# EAGLE design p2-002 (EAGLE 9.6.2)
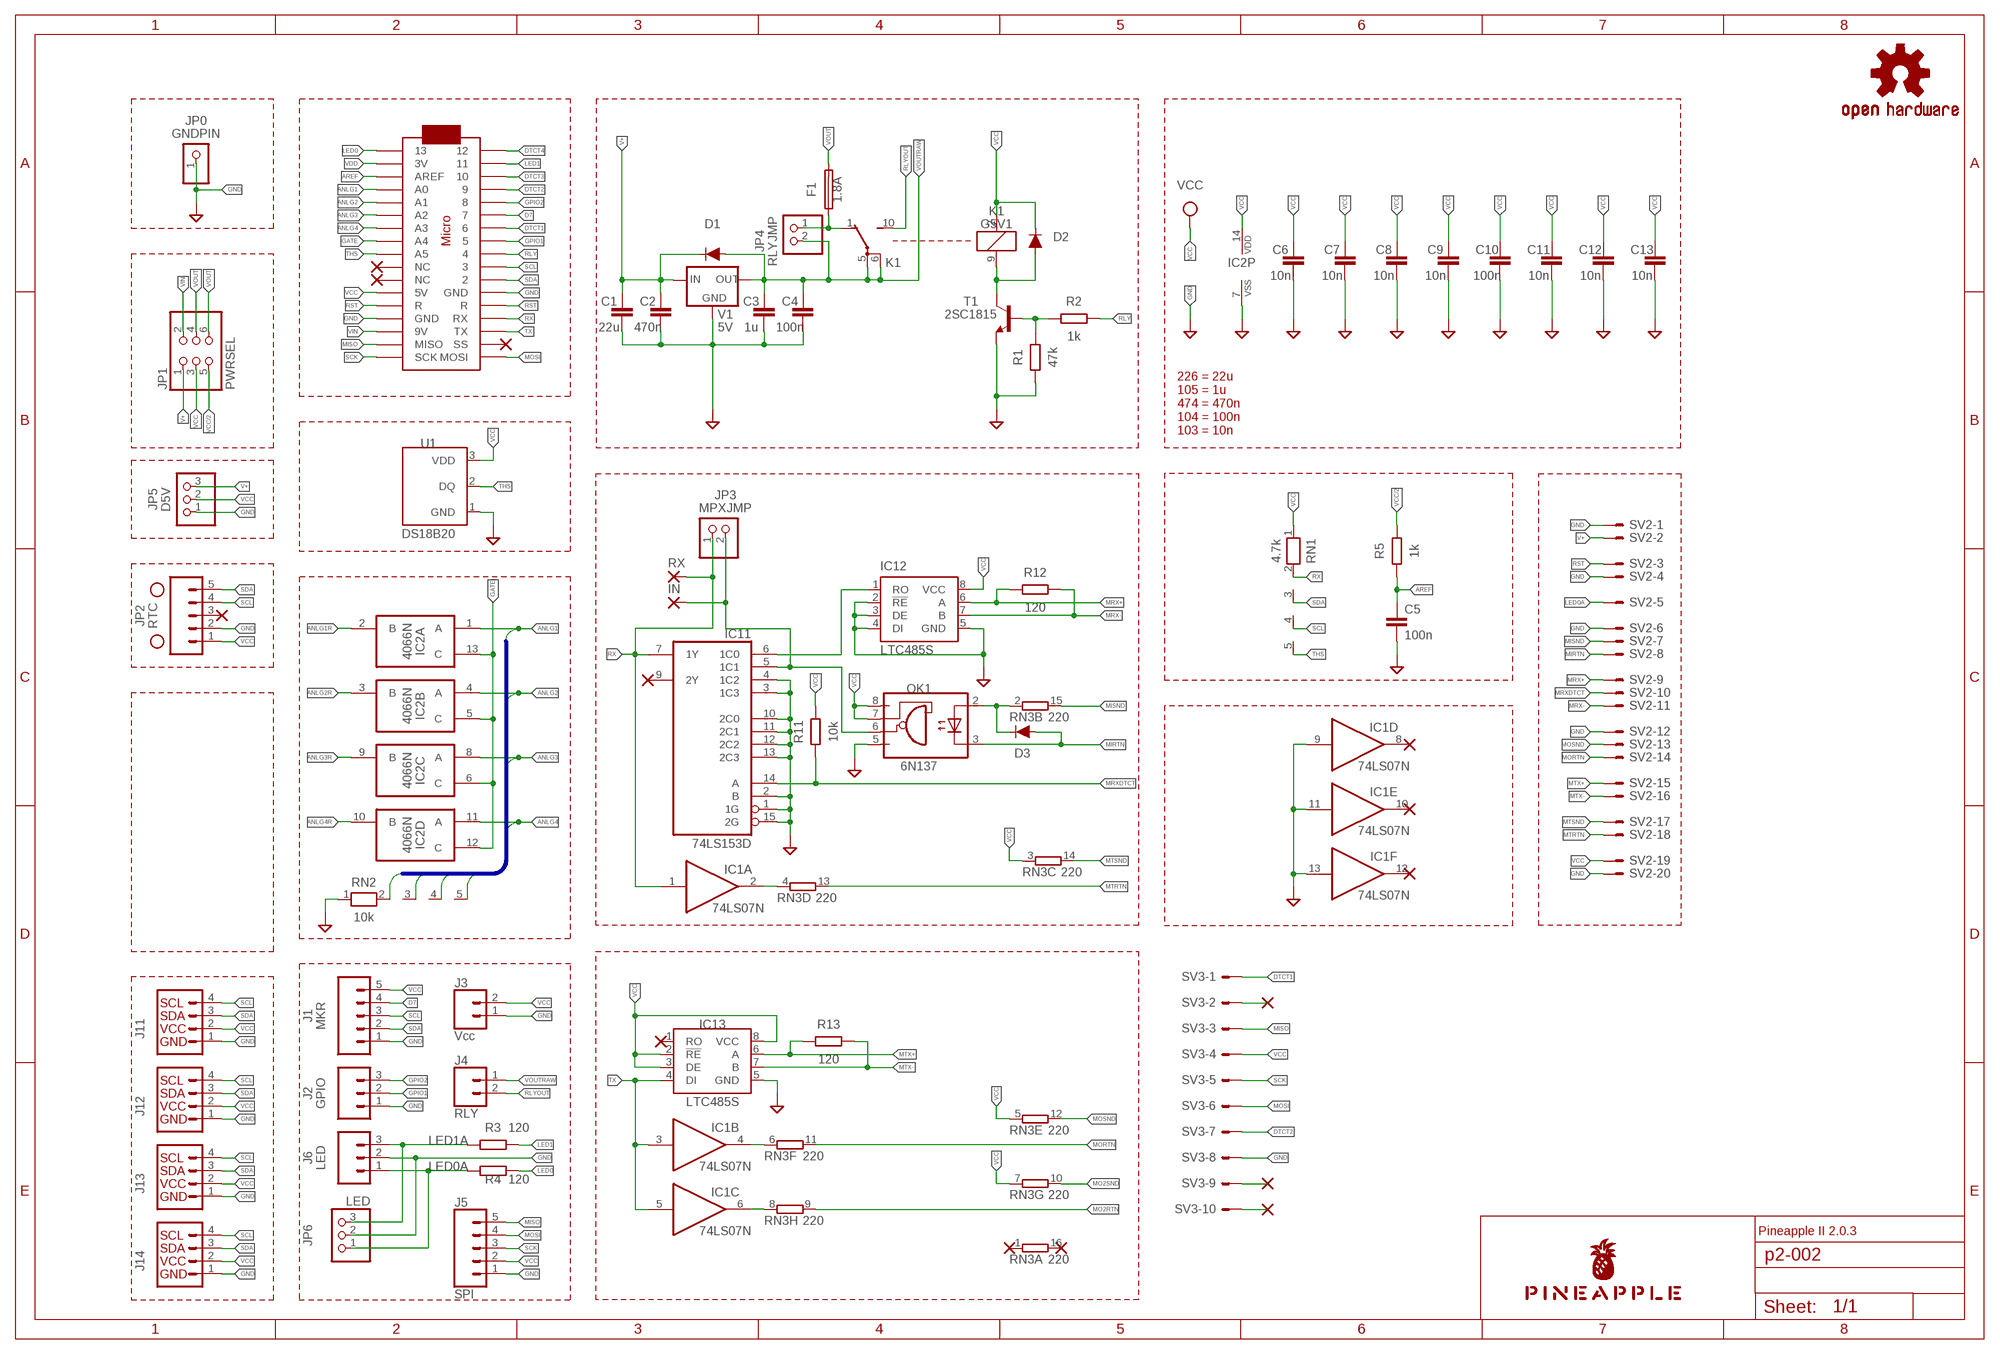
[diagram p0: schematic, sheet 1]

## Parts
C1  22u  C-EU025-050X050  [C025-050X050]
C2  470n  C-EU050-024X044  [C050-024X044]
C3  1u  C-EU050-024X044  [C050-024X044]
C4  100n  C-EU025-024X044  [C025-024X044]
C5  100n  C-EU025-024X044  [C025-024X044]
C6  10n  C-EU025-024X044  [C025-024X044]
C7  10n  C-EU025-024X044  [C025-024X044]
C8  10n  C-EU025-024X044  [C025-024X044]
C9  10n  C-EU025-024X044  [C025-024X044]
C10  100n  C-EU025-024X044  [C025-024X044]
C11  10n  C-EUC2012  [C2012]
C12  10n  C-EUC2012  [C2012]
C13  10n  C-EUC2012  [C2012]
D1  DIODE-1N4148  [DIODE-1N4148]
D2  DIODE-1N4148  [DIODE-1N4148]
D3  DIODE-1N4148  [DIODE-1N4148]
F1  1.8A  TE5  [TE5]
H1  STAND-OFF  [STAND-OFF]
H2  STAND-OFF  [STAND-OFF]
IC1  74LS07N  [DIL14]
IC2  4066N  [DIL14]
IC11  74LS153D  [SO16]
IC12  LTC485S  [SOIC8]
IC13  LTC485S  [SOIC8]
IN  SMD2  [SMD1,27-2,54]
J1  MKR  CONN_05JST  [JST-5-PTH]
J2  GPIO  CONN_03JST-PTH  [JST-3-PTH]
J3  Vcc  CONN_02JST-PTH-2  [JST-2-PTH]
J4  RLY  CONN_02-JST-2MM-SMT  [JST-2-SMD]
J5  SPI  CONN_05JST-VERT  [JST-5-PTH-VERT]
J6  LED  CONN_03JST-PTH  [JST-3-PTH]
J11  Qwiic  QWIIC_CONNECTORJS-1MM  [1X04_1MM_RA]
J12  Qwiic  QWIIC_CONNECTORJS-1MM  [1X04_1MM_RA]
J13  Qwiic  QWIIC_CONNECTORJS-1MM  [1X04_1MM_RA]
J14  Qwiic  QWIIC_CONNECTORJS-1MM  [1X04_1MM_RA]
JP0  GNDPIN  PINHD-1X1  [1X01]
JP1  PWRSEL  PINHD-2X3  [2X03]
JP2  RTC  CONN_05  [1X05]
JP3  MPXJMP  PINHD-1X2  [1X02]
JP4  RLYJMP  PINHD-1X2  [1X02]
JP5  D5V  PINHD-1X3  [1X03]
JP6  LED  PINHD-1X3  [1X03]
K1  G5V1  [G5V1]
LOGO1  OSHW-LOGOS-COPPER  [OSHW-LOGO-S_COPPER]
MC1  ARDUINOMICRO  [ARDUINOMICRO]
OK1  6N137  [DIL08]
R1  47k  R-EU_0204/5  [0204/5]
R2  1k  R-EU_0204/5  [0204/5]
R3  120  R-EU_0204/5  [0204/5]
R4  120  R-EU_0204/5  [0204/5]
R5  1k  R-EU_0204/5  [0204/5]
R11  10k  R-EU_M2012  [M2012]
R12  120  R-EU_M2012  [M2012]
R13  120  R-EU_M2012  [M2012]
RN1  4.7k  RN04  [RN-5]
RN2  10k  RN04  [RN-5]
RN3  220  8R-N  [DIL16]
RX  SMD2  [SMD1,27-2,54]
SV2  ML20LE  [ML20L]
SV3  ML10LE  [ML10L]
T1  2SC1815  [TO92-ECB]
U1  DS18B20  [TO-92-AMMO]
U$1  PINEAPPLE450_SILK  [PINEAPPLE450_SILK]
V1  5V  78XXL  [78XXL]

## Nets
ANLG1: IC2.1(A:A) MC1.P$31(A0) RN2.2
ANLG1R: IC2.2(A:B)
ANLG2: IC2.4(B:A) MC1.P$30(A1) RN2.3
ANLG2R: IC2.3(B:B)
ANLG3: IC2.8(C:A) MC1.P$29(A2) RN2.4
ANLG3R: IC2.9(C:B)
ANLG4: IC2.11(D:A) MC1.P$28(A3) RN2.5
ANLG4R: IC2.10(D:B)
AREF: C5.1 MC1.P$32(AREF) R5.1
D7: J1.4 MC1.P$6
DTCT1: MC1.P$7 SV3.1
DTCT2: MC1.P$4 SV3.7
DTCT3: MC1.P$3
DTCT4: MC1.P$1
GATE: IC2.5(B:C) IC2.6(C:C) IC2.12(D:C) IC2.13(A:C) MC1.P$27(A4)
GND [gnd]: C1.2 C2.2 C3.2 C4.2 C5.2 C6.2 C7.2 C8.2 C9.2 C10.2 C11.2 C12.2 C13.2 IC1.9(D:I) IC1.11(E:I) IC1.13(F:I) IC2.7(P:VSS) IC11.1(1G) IC11.2(B) IC11.3(1C3) IC11.4(1C2) IC11.10(2C0) IC11.11(2C1) IC11.12(2C2) IC11.13(2C3) IC11.15(2G) IC12.2(!RE) IC12.3(DE) IC12.4(DI) IC12.5(GND) IC13.5(GND) J1.1 J2.1 J3.1 J5.1 J6.2 J11.1(GND) J12.1(GND) J13.1(GND) J14.1(GND) JP0.1 JP2.2 JP5.1 JP6.2 MC1.P$12(GND) MC1.P$21(GND) OK1.5(GND) R1.1 RN2.1 SV2.1 SV2.4 SV2.6 SV2.12 SV2.20 SV3.8 T1.E U1.1(GND) V1.GND
GPIO1: J2.2 MC1.P$8
GPIO2: J2.3 MC1.P$5
LED0: MC1.P$34 R4.2
LED0A: J6.1 JP6.1 R4.1 SV2.5
LED1: MC1.P$2 R3.2
LED1A: J6.3 JP6.3 R3.1
MIDIINSND: D3.C OK1.2(A) RN3.2
MIN: IC11.5(1C1) IN.1(P) JP3.2 OK1.6(VO)
MIRTN: D3.A OK1.3(C) SV2.8
MISND: RN3.15 SV2.7
MISO: J5.5 MC1.P$19(MISO) SV3.3
MO: IC1.4(B:O) RN3.6
MO2: IC1.6(C:O) RN3.8
MO2RTN: RN3.9
MO2SND: RN3.10
MORTN: RN3.11 SV2.14
MOSI: J5.4 MC1.P$17(MOSI) SV3.6
MOSND: RN3.12 SV2.13
MRX: IC11.6(1C0) IC12.1(RO)
MRX+: IC12.6(A) R12.1 SV2.9
MRX-: IC12.7(B) R12.2 SV2.11
MRXDTCT: IC11.14(A) R11.1 SV2.10
MT: IC1.2(A:O) RN3.4
MTRTN: RN3.13 SV2.18
MTSND: RN3.14 SV2.17
MTX+: IC13.6(A) R13.1 SV2.15
MTX-: IC13.7(B) R13.2 SV2.16
NC1: SV3.2
NC2: SV3.9
NC3: SV3.10
RLY: MC1.P$9 R2.2
RLYDRV: R1.2 R2.1 T1.B
RLYOUT: J4.2 K1.10(2:S)
RLYSNK: D2.A K1.9 T1.C
RST: MC1.P$13(R) MC1.P$22(R) SV2.3
RX: IC1.1(A:I) IC11.7(1Y) JP3.1 MC1.P$14(RX) RN1.2 RX.1(P)
SCK: J5.3 MC1.P$18(SCK) SV3.5
SCL: J1.3 J11.4(SCL) J12.4(SCL) J13.4(SCL) J14.4(SCL) JP2.4 MC1.P$10 RN1.4
SDA: J1.2 J11.3(SDA) J12.3(SDA) J13.3(SDA) J14.3(SDA) JP2.5 MC1.P$11 RN1.3
THS: MC1.P$26(A5) RN1.5 U1.2(DQ)
TX: IC1.3(B:I) IC1.5(C:I) IC13.4(DI) MC1.P$15(TX)
V+ [power]: C1.1 C2.1 D1.C JP1.1 JP5.3 SV2.2 V1.IN
VCC [power]: C6.1 C7.1 C8.1 C9.1 C10.1 C11.1 C12.1 C13.1 D2.C IC2.14(P:VDD) IC12.8(VCC) IC13.2(!RE) IC13.3(DE) IC13.8(VCC) J1.5 J3.2 J5.2 J11.2(VCC) J12.2(VCC) J13.2(VCC) J14.2(VCC) JP1.3 JP2.1 JP5.2 K1.2 MC1.P$23(5V) OK1.7(VE) OK1.8(VCC) R11.2 RN1.1 RN3.3 RN3.5 RN3.7 SV2.19 SV3.4 U1.3(VDD)
VCC/2 [power]: JP1.5 R5.2
VDD [power]: MC1.P$33(3V)
VIN [power]: JP1.2 MC1.P$20(9V)
VOUT [power]: F1.2 JP1.4 JP1.6
VOUTRAW [power]: C3.1 C4.1 D1.A J4.1 JP4.2 K1.5(2:P) K1.6(2:P) V1.OUT
VOUTRAW2 [power]: F1.1 JP4.1 K1.1(2:O)
Unconnected: IC1.8(D:O) IC1.10(E:O) IC1.12(F:O) IC11.9(2Y) IC13.1(RO) JP2.3 MC1.P$16(SS) MC1.P$24(NC) MC1.P$25(NC) RN3.1 RN3.16

## Buses
ANLG[1..4]

## Notes on the sheet
- 226 = 22u
  105 = 1u
  474 = 470n
  104 = 100n
  103 = 10n
- Pineapple II 2.0.3

## Power pins joined to a net without a drawn wire
GND: IC1.7(P:GND) IC11.8(GND)
VCC: IC1.14(P:VCC) IC11.16(VCC)

## Library data of the parts
C1-C5 C10-C13 = rcl:C-EU: CAPACITOR, European symbol; SPICEPREFIX: C
C6-C9 = resistor:C-EU: CAPACITOR, European symbol
D1-D3 = SparkFun-DiscreteSemi:DIODE: Diode These are standard reverse protection diodes and small signal diodes. SparkFun Products: SparkFun SparkPunk Sound Kit <https://www.sparkfun.com/products/11177> SparkFun ESP8266 Thing <https://www.sparkfun.com/products/13231>; PROD_ID: DIO-08378; VALUE: 200mA/100V/1V
F1 = fuse:TE5: FUSE Wickmann; OC_FARNELL: unknown; OC_NEWARK: unknown
H1 H2 = SparkFun-Hardware:STAND-OFF: Stand Off Drill holes for mechanically mounting via screws, standoffs, etc. Note: Use the keepout ring to avoid running the screw head into surrounding components. Variant Overviews STAND-OFF - Mechanical footprint for a #4 phillips button head screw. STAND-OFF-TIGHT - Mechanical footprint for a #4 phillips button head screw, Example SparkFun Products Screw - Phillips Head (1/4", 4-40, 10 pack) <https://www.sparkfun.com/products/10453> (PRT-10453) Screw - Phillips Head (1/2", 4-40, 10 pack) <https://www.sparkfun.com/products/10452> (PRT-10452) Screw - Phillips Head (3/4", 4-40, 10 pack) <https://www.sparkfun.com/products/10451> (PRT-10451) Screw - Phillips Head (1", 4-40, 10 pack) <https://www.sparkfun.com/products/10450> (PRT-10450)
IC1 = 74xx-us:74*07: Hex BUFFER, open collector high-voltage output
IC2 = 40xx:4066: Quad bilateral ANALOG SWITCH
IC11 = 74xx-us:74*153: Dual 4-line to 1-line data SELECTOR/MULTIPLEXER
IC12 IC13 = linear-technology:LTC485: Low Power RS485 Interface Transceiver Source: http://www.linear.com/pc/downloadDocument.do?navId=H0,C1,C1007,C1017,P2064,D1718; OC_FARNELL: unknown; OC_NEWARK: unknown
IN RX = wirepad:SMD2: SMD PAD
J1 = SparkFun-Connectors:CONN_05: Multi connection point. Often used as Generic Header-pin footprint for 0.1 inch spaced/style header connections On any of the 0.1 inch spaced packages, you can populate with these: Break Away Headers - Straight <https://www.sparkfun.com/products/116> (PRT-00116) Break Away Male Headers - Right Angle <https://www.sparkfun.com/products/553> (PRT-00553) Female Headers <https://www.sparkfun.com/products/115> (PRT-00115) Break Away Headers - Machine Pin <https://www.sparkfun.com/products/117> (PRT-00117) Break Away Female Headers - Swiss Machine Pin <https://www.sparkfun.com/products/743> (PRT-00743) For SCREWTERMINALS and SPRING TERMINALS visit here: Screw Terimnals on SparkFun.com <https://www.sparkfun.com/search/results?term=Screw+Terminals> (5mm/3.5mm/2.54mm spacing) This device is also useful as a general connection point to wire up your design to another part of your project. Our various solder wires solder well into these plated through hole pads. Hook-Up Wire - Assortment (Stranded, 22 AWG) <https://www.sparkfun.com/products/11375> (PRT-11375) Hook-Up Wire - Assortment (Solid Core, 22 AWG) <https://www.sparkfun.com/products/11367> (PRT-11367) View the entire wire category on our website here <https://www.sparkfun.com/categories/141> Special notes: Molex polarized connector foot print use with SKU : PRT-08231 with associated crimp pins and housings. 1MM SMD Version SKU: PRT-10208; SF_ID: PRT-09917
J2 J6 = SparkFun-Connectors:CONN_03: Multi connection point. Often used as Generic Header-pin footprint for 0.1 inch spaced/style header connections On any of the 0.1 inch spaced packages, you can populate with these: Break Away Headers - Straight <https://www.sparkfun.com/products/116> (PRT-00116) Break Away Male Headers - Right Angle <https://www.sparkfun.com/products/553> (PRT-00553) Female Headers <https://www.sparkfun.com/products/115> (PRT-00115) Break Away Headers - Machine Pin <https://www.sparkfun.com/products/117> (PRT-00117) Break Away Female Headers - Swiss Machine Pin <https://www.sparkfun.com/products/743> (PRT-00743) Stackable Header - 3 Pin (Female, 0.1") <https://www.sparkfun.com/products/13875> (PRT-13875) For SCREWTERMINALS and SPRING TERMINALS visit here: Screw Terimnals on SparkFun.com <https://www.sparkfun.com/search/results?term=Screw+Terminals> (5mm/3.5mm/2.54mm spacing) This device is also useful as a general connection point to wire up your design to another part of your project. Our various solder wires solder well into these plated through hole pads. Hook-Up Wire - Assortment (Stranded, 22 AWG) <https://www.sparkfun.com/products/11375> (PRT-11375) Hook-Up Wire - Assortment (Solid Core, 22 AWG) <https://www.sparkfun.com/products/11367> (PRT-11367) View the entire wire category on our website here <https://www.sparkfun.com/categories/141> Special notes: Molex polarized connector foot print use with SKU : PRT-08232 with associated crimp pins and housings.; PROD_ID: WIRE-10037; SF_ID: PRT-09915
J3 = SparkFun-Connectors:CONN_02: Multi connection point. Often used as Generic Header-pin footprint for 0.1 inch spaced/style header connections On any of the 0.1 inch spaced packages, you can populate with these: Break Away Headers - Straight <https://www.sparkfun.com/products/116> (PRT-00116) Break Away Male Headers - Right Angle <https://www.sparkfun.com/products/553> (PRT-00553) Female Headers <https://www.sparkfun.com/products/115> (PRT-00115) Break Away Headers - Machine Pin <https://www.sparkfun.com/products/117> (PRT-00117) Break Away Female Headers - Swiss Machine Pin <https://www.sparkfun.com/products/743> (PRT-00743) For SCREWTERMINALS and SPRING TERMINALS visit here: Screw Terimnals on SparkFun.com <https://www.sparkfun.com/search/results?term=Screw+Terminals> (5mm/3.5mm/2.54mm spacing) This device is also useful as a general connection point to wire up your design to another part of your project. Our various solder wires solder well into these plated through hole pads. Hook-Up Wire - Assortment (Stranded, 22 AWG) <https://www.sparkfun.com/products/11375> (PRT-11375) Hook-Up Wire - Assortment (Solid Core, 22 AWG) <https://www.sparkfun.com/products/11367> (PRT-11367) View the entire wire category on our website here <https://www.sparkfun.com/categories/141> Special notes: Molex polarized connector foot print use with: PRT-08233 with associated crimp pins and housings. 2.54_SCREWTERM for use with PRT-10571. 3.5mm Screw Terminal footprints for PRT-08084 5mm Screw Terminal footprints for use with PRT-08432; PROD_ID: CONN-09863; SKU: PRT-09914
J4 = SparkFun-Connectors:CONN_02: Multi connection point. Often used as Generic Header-pin footprint for 0.1 inch spaced/style header connections On any of the 0.1 inch spaced packages, you can populate with these: Break Away Headers - Straight <https://www.sparkfun.com/products/116> (PRT-00116) Break Away Male Headers - Right Angle <https://www.sparkfun.com/products/553> (PRT-00553) Female Headers <https://www.sparkfun.com/products/115> (PRT-00115) Break Away Headers - Machine Pin <https://www.sparkfun.com/products/117> (PRT-00117) Break Away Female Headers - Swiss Machine Pin <https://www.sparkfun.com/products/743> (PRT-00743) For SCREWTERMINALS and SPRING TERMINALS visit here: Screw Terimnals on SparkFun.com <https://www.sparkfun.com/search/results?term=Screw+Terminals> (5mm/3.5mm/2.54mm spacing) This device is also useful as a general connection point to wire up your design to another part of your project. Our various solder wires solder well into these plated through hole pads. Hook-Up Wire - Assortment (Stranded, 22 AWG) <https://www.sparkfun.com/products/11375> (PRT-11375) Hook-Up Wire - Assortment (Solid Core, 22 AWG) <https://www.sparkfun.com/products/11367> (PRT-11367) View the entire wire category on our website here <https://www.sparkfun.com/categories/141> Special notes: Molex polarized connector foot print use with: PRT-08233 with associated crimp pins and housings. 2.54_SCREWTERM for use with PRT-10571. 3.5mm Screw Terminal footprints for PRT-08084 5mm Screw Terminal footprints for use with PRT-08432; PROD_ID: CONN-11443
J5 JP2 = SparkFun-Connectors:CONN_05: Multi connection point. Often used as Generic Header-pin footprint for 0.1 inch spaced/style header connections On any of the 0.1 inch spaced packages, you can populate with these: Break Away Headers - Straight <https://www.sparkfun.com/products/116> (PRT-00116) Break Away Male Headers - Right Angle <https://www.sparkfun.com/products/553> (PRT-00553) Female Headers <https://www.sparkfun.com/products/115> (PRT-00115) Break Away Headers - Machine Pin <https://www.sparkfun.com/products/117> (PRT-00117) Break Away Female Headers - Swiss Machine Pin <https://www.sparkfun.com/products/743> (PRT-00743) For SCREWTERMINALS and SPRING TERMINALS visit here: Screw Terimnals on SparkFun.com <https://www.sparkfun.com/search/results?term=Screw+Terminals> (5mm/3.5mm/2.54mm spacing) This device is also useful as a general connection point to wire up your design to another part of your project. Our various solder wires solder well into these plated through hole pads. Hook-Up Wire - Assortment (Stranded, 22 AWG) <https://www.sparkfun.com/products/11375> (PRT-11375) Hook-Up Wire - Assortment (Solid Core, 22 AWG) <https://www.sparkfun.com/products/11367> (PRT-11367) View the entire wire category on our website here <https://www.sparkfun.com/categories/141> Special notes: Molex polarized connector foot print use with SKU : PRT-08231 with associated crimp pins and housings. 1MM SMD Version SKU: PRT-10208
J11-J14 = SparkFun-Connectors:QWIIC_CONNECTOR: SparkFun I2C Standard Qwiic Connector An SMD 1mm pitch JST connector makes it easy and quick (get it? Qwiic?) to connect I2C devices to each other. The Qwiic system <http://www.sparkfun.com/qwiic> enables fast and solderless connection between popular platforms and various sensors and actuators. We carry 200mm <https://www.sparkfun.com/products/14204>, 100mm <https://www.sparkfun.com/products/14205>, 50mm <https://www.sparkfun.com/products/14206>, and breadboard friendly <https://www.sparkfun.com/products/14207> Qwiic cables. We also offer 10 pcs strips <https://www.sparkfun.com/products/14323> the SMD connectors.
JP0 = pinhead:PINHD-1X1: PIN HEADER
JP1 = pinhead:PINHD-2X3: PIN HEADER
JP3 JP4 = pinhead:PINHD-1X2: PIN HEADER
JP5 JP6 = pinhead:PINHD-1X3: PIN HEADER
K1 = relay:G5V1: RELAY 1 x switch, 0.5 A/125 V AC, 1 A/24 V DC , Omron; MPN: G5V-1-DC24; OC_FARNELL: 9949593; OC_NEWARK: 36M6377
LOGO1 = SparkFun-Aesthetics:OSHW-LOGO: Open-Source Hardware (OSHW) Logo This logo indicates the piece of hardware it is found on incorporates a OSHW license and/or adheres to the definition of open source hardware found here: http://freedomdefined.org/OSHW
MC1 = adafruit:ARDUINOMICRO
OK1 = optocoupler:6N137: MOTOROLA OPTO COUPLER; MPN: 6N137; OC_FARNELL: 1328376; OC_NEWARK: 52M1895
R1-R5 = resistor:R-EU_: RESISTOR, European symbol
R11-R13 = rcl:R-EU_: RESISTOR, European symbol; SPICEPREFIX: R
RN1 RN2 = resistor-net:RN04: RESISTOR NETWORK; OC_FARNELL: unknown; OC_NEWARK: unknown
RN3 = resistor-dil:8R-N: DIL RESISTOR; OC_FARNELL: unknown; OC_NEWARK: unknown
SV2 = con-ml:ML20LE: HARTING; OC_FARNELL: unknown; OC_NEWARK: unknown
SV3 = con-ml:ML10LE: HARTING; OC_FARNELL: unknown; OC_NEWARK: unknown
T1 = transistor:2SC1815: NPN EPITAXIAL TRANSISTOR Source: TOSHIBA .. 2SC1815 1.pdf
U1 = SparkFun-Sensors:DS18B20: Dallas/Maxim DS18B20 1-Wire Temperature Sensor The DS18B20 reports degrees C with 9 to 12-bit precision, -55C to 125C (+/-0.5C). Each sensor has a unique 64-Bit Serial number etched into it - allows for a huge number of sensors to be used on one data bus. Datasheet <http://datasheets.maximintegrated.com/en/ds/DS18B20.pdf> SparkFun Products One Wire Digital Temperature Sensor - DS18B20 <https://www.sparkfun.com/products/245> (SEN-00245); STORE_ID: SEN-00245
U$1 = pineapple:PINEAPPLE450_SILK
V1 = v-reg:78XXL: VOLTAGE REGULATOR

## Net classes
0 default: width 0.152 mm, drill 0.152 mm, clearance 0.152 mm
1 gnd: width 0.61 mm, drill 0.152 mm, clearance 0.152 mm
2 power: width 0.61 mm, drill 0.152 mm, clearance 0.152 mm
3 analog: width 0.305 mm, drill 0.152 mm, clearance 0.152 mm

## Board
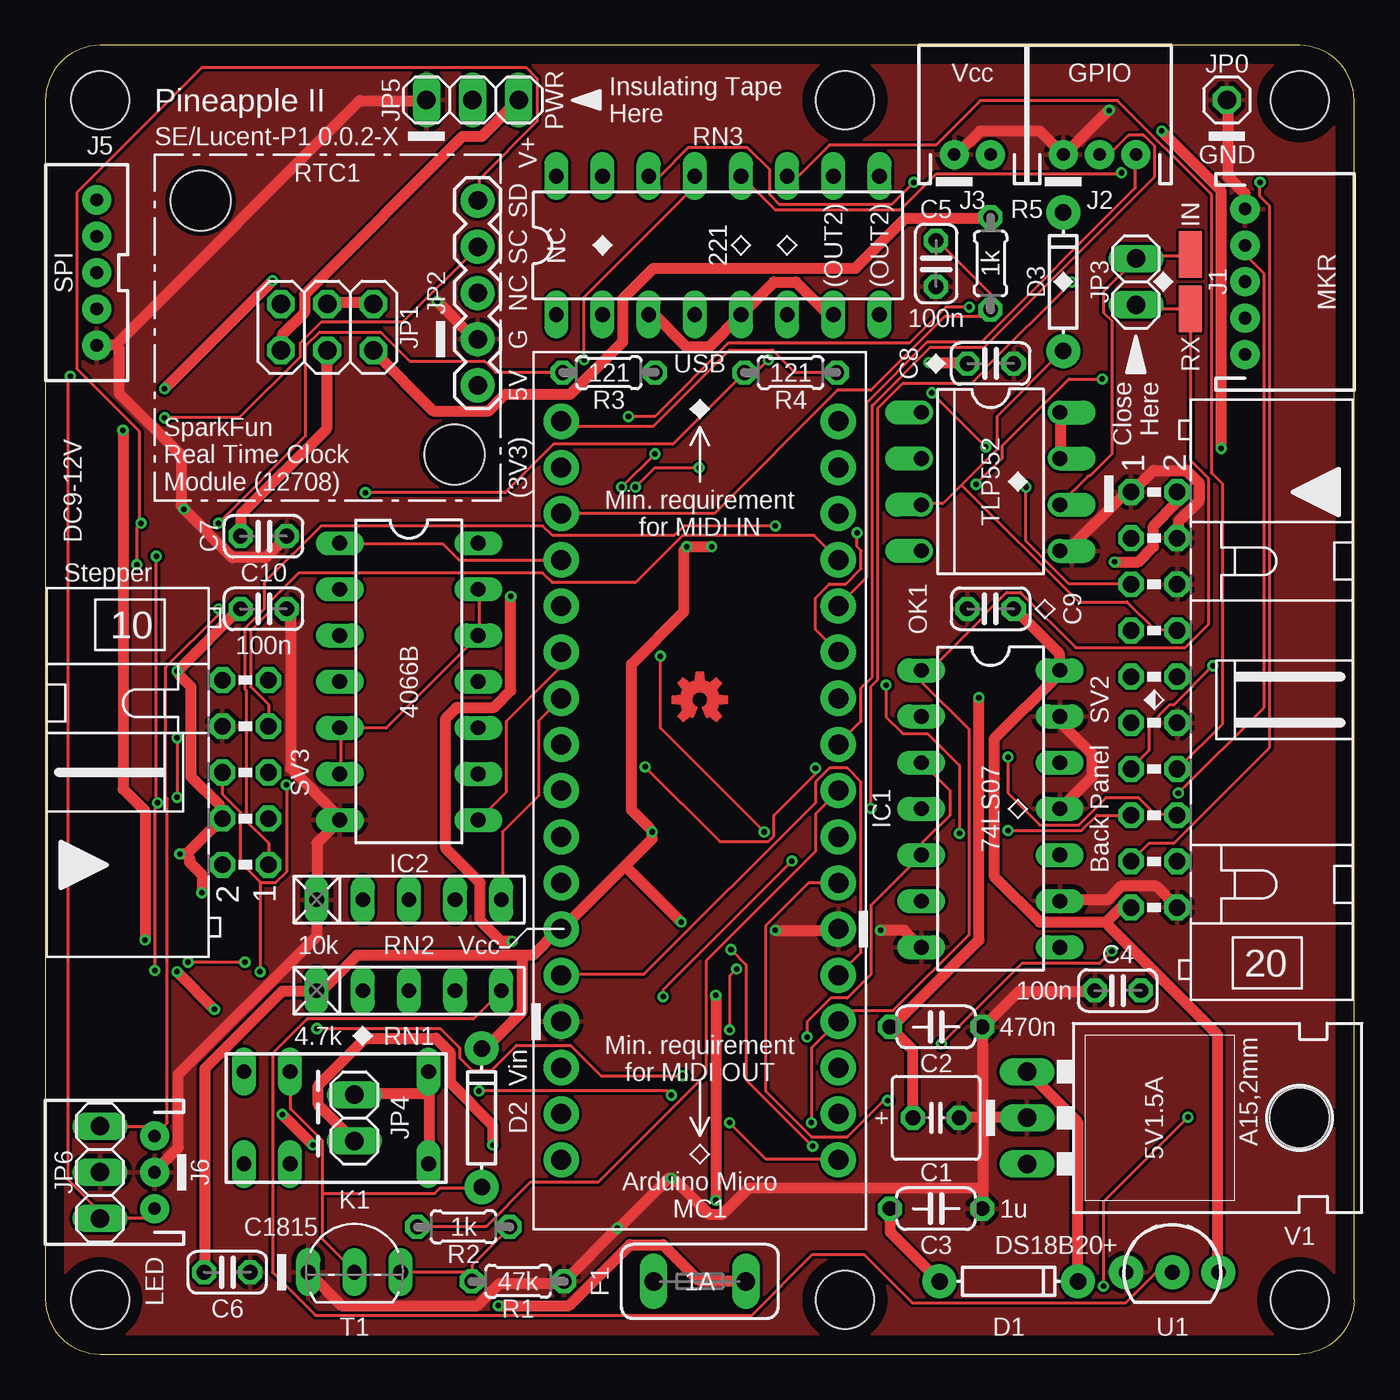
[diagram p1: board, top side]
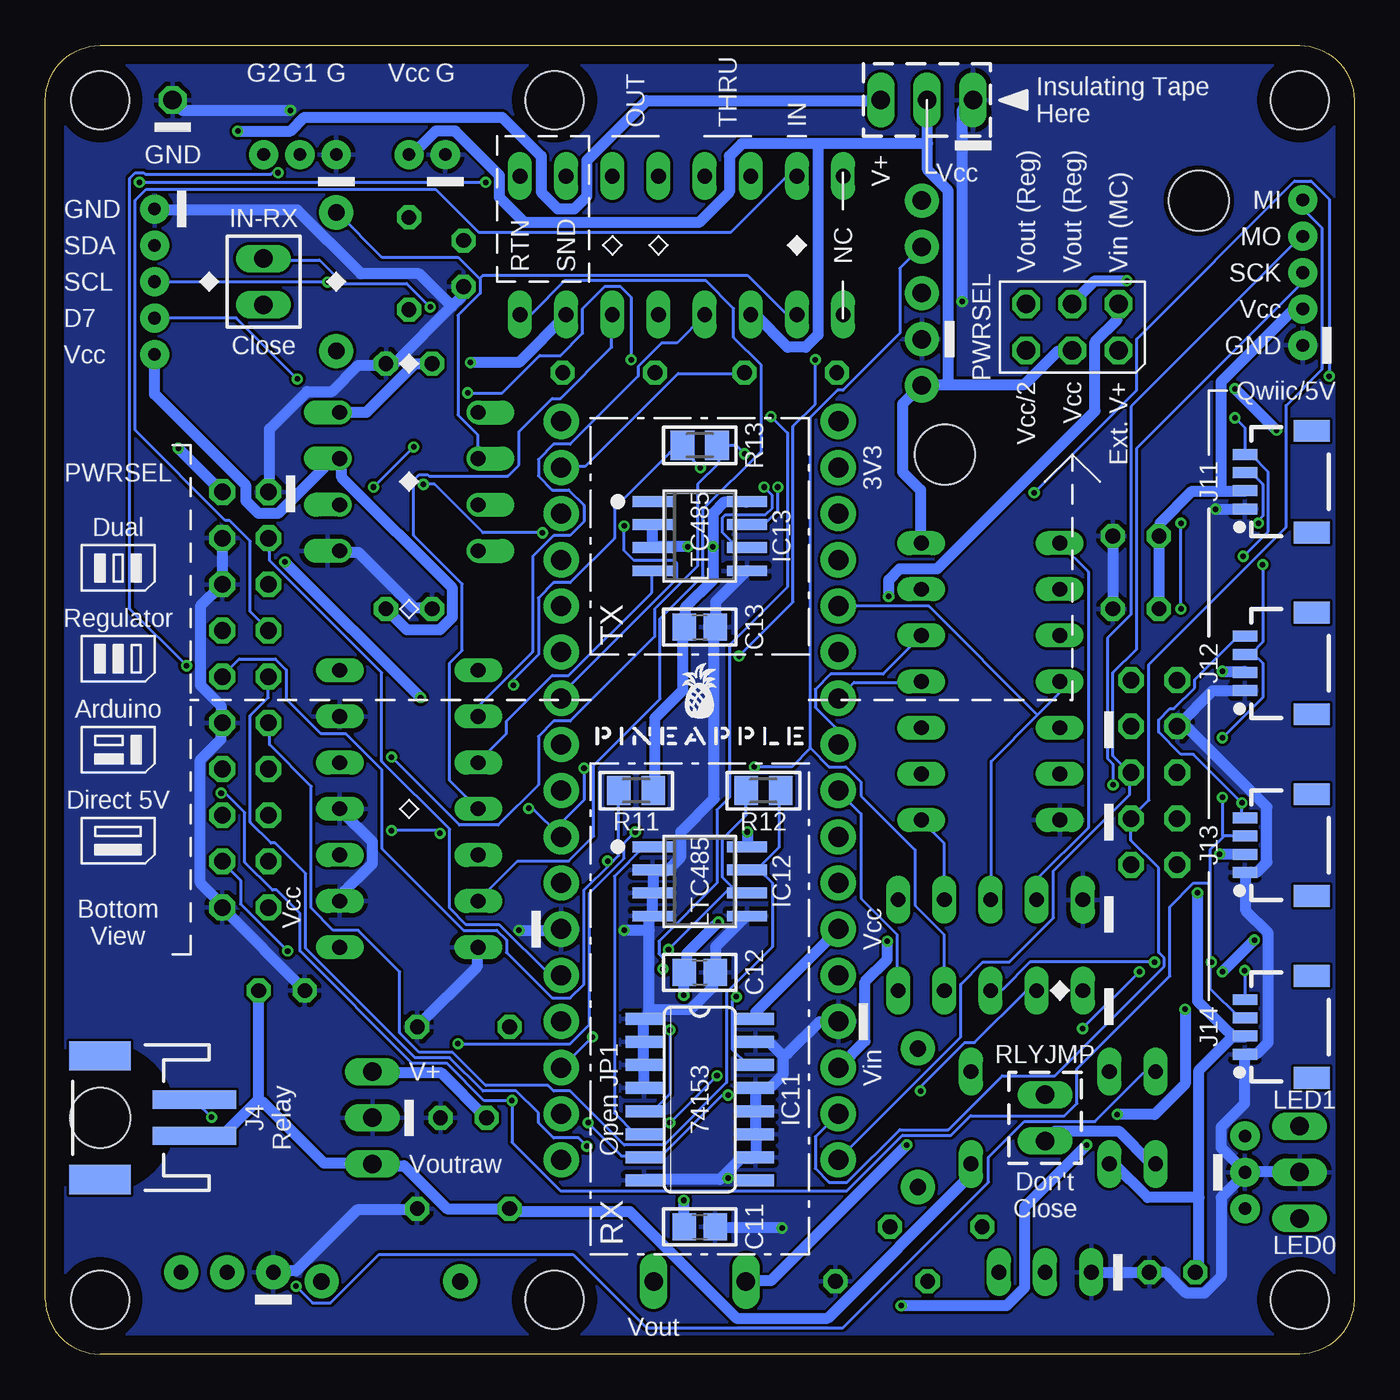
[diagram p2: board, bottom side, seen from below]

Size 72 x 72 mm. Coordinates in mm from the lower left corner, seen from the top.
Outline: 3,0 69,0 arc90 72,3 72,69 arc90 69,72 3,72 arc90 0,69 0,3 arc90 3,0
Copper layers (1*16): Top 0.035mm / dielectric 1.5mm / Bottom 0.035mm
Design rules "SeeedStudio_2layer_DRU_no_angle_20140221": minimum track width 6mil, minimum drill 12mil, track to track 6mil, track to pad 6mil, pad to pad 6mil, via to via 6mil, smd to smd 0mil, copper to edge 10mil, drill to drill 10mil, minimum pad ring 10mil, minimum via ring 6mil, stop-mask expansion 2mil, vias tented up to drill 100mil, thermal gap 10mil
Holes 3.2 mm at 3,3 69,3 69,69 3,69 44,69 44,3
tRestrict: area 0.8,66.8 to 5.2,71.2; area 66.8,66.8 to 71.2,71.2; area 0.8,0.8 to 5.2,5.2; area 66.8,0.8 to 71.2,5.2; area 41.8,66.8 to 46.2,71.2; area 41.8,0.8 to 46.2,5.2; area 0,71 to 72,72; area 0,0 to 72,1; area 0,0 to 1,72; area 71,0 to 72,72
bRestrict: area 0.8,0.8 to 5.2,5.2; area 66.8,0.8 to 71.2,5.2; area 66.8,66.8 to 71.2,71.2; area 0.8,66.8 to 5.2,71.2; area 41.8,66.8 to 46.2,71.2; area 41.8,0.8 to 46.2,5.2; area 0,71 to 72,72; area 0,0 to 72,1; area 0,0 to 1,72; area 71,0 to 72,72
vRestrict: area 30,33 to 42,38

### Footprints (pad centres in the part's own frame; a part is rotated, then mirrored left to right if it is on the bottom)
C025-050X050 = drill 0.813 octagon: 1 -1.27,0; 2 1.27,0
C050-024X044 = drill 0.813 octagon: 1 -2.54,0; 2 2.54,0
C025-024X044 = drill 0.813 octagon: 1 -1.27,0; 2 1.27,0
C2012 = smd 1.3 x 1.5: 1 -0.85,0; 2 0.85,0
DIODE-1N4148 = drill 0.9 pad 1.88: A -3.81,0; C 3.81,0
TE5 = drill 1.016 long: 1 -2.54,0; 2 2.54,0
STAND-OFF = hole 3.302: 0,0
DIL14 = drill 0.813 long: 1 -7.62,-3.81; 2 -5.08,-3.81; 3 -2.54,-3.81; 4 0,-3.81; 5 2.54,-3.81; 6 5.08,-3.81; 7 7.62,-3.81; 8 7.62,3.81; 9 5.08,3.81; 10 2.54,3.81; 11 0,3.81; 12 -2.54,3.81; 13 -5.08,3.81; 14 -7.62,3.81
SO16 = smd 0.66 x 2.032: 1 -4.445,-3.073; 2 -3.175,-3.073; 3 -1.905,-3.073; 4 -0.635,-3.073; 5 0.635,-3.073; 6 1.905,-3.073; 7 3.175,-3.073; 8 4.445,-3.073; 9 4.445,3.073; 10 3.175,3.073; 11 1.905,3.073; 12 0.635,3.073; 13 -0.635,3.073; 14 -1.905,3.073; 15 -3.175,3.073; 16 -4.445,3.073
SOIC8 = smd 0.6 x 2.2: 1 -1.905,-2.6; 2 -0.635,-2.6; 3 0.635,-2.6; 4 1.905,-2.6; 5 1.905,2.6; 6 0.635,2.6; 7 -0.635,2.6; 8 -1.905,2.6
SMD1,27-2,54 = smd 1.27 x 2.54: 1 0,0
JST-5-PTH = drill 0.7 pad 1.6: 1 -4,0; 2 -2,0; 3 0,0; 4 2,0; 5 4,0
JST-3-PTH = drill 0.7 pad 1.6: 1 -2,0; 2 0,0; 3 2,0
JST-2-PTH = drill 0.7 pad 1.6: 1 -1,0; 2 1,0
JST-2-SMD = smd 1 x 4.6: 1 -1,-3.7; 2 1,-3.7 | smd 1.6 x 3.4: NC1 -3.4,1.5; NC2 3.4,1.5
JST-5-PTH-VERT = drill 0.7 pad 1.6: 1 -4,0.18; 2 -2,0.18; 3 0,0.18; 4 2,0.18; 5 4,0.18
1X04_1MM_RA = smd 0.6 x 1.35: 1 -1.5,0; 2 -0.5,0; 3 0.5,0; 4 1.5,0 | smd 1.2 x 2: NC1 2.8,-3.675; NC2 -2.8,-3.675
1X01 = drill 1.016 octagon: 1 0,0
2X03 = drill 1.016 octagon: 1 -2.54,-1.27; 2 -2.54,1.27; 3 0,-1.27; 4 0,1.27; 5 2.54,-1.27; 6 2.54,1.27
1X05 = drill 1.016 pad 1.88: 1 0,0; 2 2.54,0; 3 5.08,0; 4 7.62,0; 5 10.16,0
1X02 = drill 1.016 long: 1 -1.27,0; 2 1.27,0
1X03 = drill 1.016 long: 1 -2.54,0; 2 0,0; 3 2.54,0
G5V1 = drill 0.813 long: 1 -5.08,-2.54; 2 -2.54,-2.54; 5 5.08,-2.54; 6 5.08,2.54; 9 -2.54,2.54; 10 -5.08,2.54
ARDUINOMICRO = drill 1.1 pad 1.93: P$1 -20.32,7.62; P$2 -17.78,7.62; P$3 -15.24,7.62; P$4 -12.7,7.62; P$5 -10.16,7.62; P$6 -7.62,7.62; P$7 -5.08,7.62; P$8 -2.54,7.62; P$9 0,7.62; P$10 2.54,7.62; P$11 5.08,7.62; P$12 12.7,-7.62; P$13 10.16,-7.62; P$14 12.7,7.62; P$15 15.24,7.62; P$16 17.78,7.62; P$17 20.32,7.62; P$18 20.32,-7.62; P$19 17.78,-7.62; P$20 15.24,-7.62; P$21 7.62,7.62; P$22 10.16,7.62; P$23 7.62,-7.62; P$24 5.08,-7.62; P$25 2.54,-7.62; P$26 0,-7.62; P$27 -2.54,-7.62; P$28 -5.08,-7.62; P$29 -7.62,-7.62; P$30 -10.16,-7.62; P$31 -12.7,-7.62; P$32 -15.24,-7.62; P$33 -17.78,-7.62; P$34 -20.32,-7.62
DIL08 = drill 0.813 offset: 1 -3.81,-3.81; 2 -1.27,-3.81; 3 1.27,-3.81; 4 3.81,-3.81; 5 3.81,3.81; 6 1.27,3.81; 7 -1.27,3.81; 8 -3.81,3.81
0204/5 = drill 0.813 octagon: 1 -2.54,0; 2 2.54,0
M2012 = smd 1.3 x 1.6: 1 -0.95,0; 2 0.95,0
RN-5 = drill 0.813 long: 1 -5.08,0; 2 -2.54,0; 3 0,0; 4 2.54,0; 5 5.08,0
DIL16 = drill 0.813 long: 1 -8.89,-3.81; 2 -6.35,-3.81; 3 -3.81,-3.81; 4 -1.27,-3.81; 5 1.27,-3.81; 6 3.81,-3.81; 7 6.35,-3.81; 8 8.89,-3.81; 9 8.89,3.81; 10 6.35,3.81; 11 3.81,3.81; 12 1.27,3.81; 13 -1.27,3.81; 14 -3.81,3.81; 15 -6.35,3.81; 16 -8.89,3.81
ML20L = drill 0.914 octagon: 1 -11.43,-1.27; 2 -11.43,1.27; 3 -8.89,-1.27; 4 -8.89,1.27; 5 -6.35,-1.27; 6 -6.35,1.27; 7 -3.81,-1.27; 8 -3.81,1.27; 9 -1.27,-1.27; 10 -1.27,1.27; 11 1.27,-1.27; 12 1.27,1.27; 13 3.81,-1.27; 14 3.81,1.27; 15 6.35,-1.27; 16 6.35,1.27; 17 8.89,-1.27; 18 8.89,1.27; 19 11.43,-1.27; 20 11.43,1.27
ML10L = drill 0.914 octagon: 1 -5.08,-1.27; 2 -5.08,1.27; 3 -2.54,-1.27; 4 -2.54,1.27; 5 0,-1.27; 6 0,1.27; 7 2.54,-1.27; 8 2.54,1.27; 9 5.08,-1.27; 10 5.08,1.27
TO92-ECB = drill 0.813 long: B 2.54,0; C 0,0; E -2.54,0
TO-92-AMMO = drill 0.813 pad 1.88: 1 -2.54,0; 2 0,0; 3 2.54,0
78XXL = drill 1.016 long: GND 0,-3.81; IN -2.54,-3.81; OUT 2.54,-3.81 | hole 3.302: 0,11.176

### Placement (x,y rotation side)
C1  49,13 0 top
C2  49,18 0 top
C3  49,8 0 top
C4  59,20 180 top
C5  49,60 270 top
C6  10,4.5 0 top
C7  12,45 0 top
C8  52,54.5 0 top
C9  52,41 180 top
C10  12,41 0 top
C11  36,7 0 bottom
C12  36,21 0 bottom
C13  36,40 0 bottom
D1  53,4 0 top
D2  24,13 90 top
D3  56,59 90 top
F1  36,4 0 top
H1  22.51,49.49 0 top
H2  8.54,63.46 0 top
IC1  52,30 270 top
IC2  20,37 270 top
IC11  36,14 270 bottom
IC12  36,26 270 bottom
IC13  36,45 270 bottom
IN  63,60.5 0 top
J1  66,59 270 top
J2  58,66 0 top
J3  51,66 0 top
J4  67.5,13 90 bottom
J5  3,59.5 90 top
J6  6,10 90 top
J11  6,48 90 bottom
J12  6,38 90 bottom
J13  6,28 90 bottom
J14  6,18 90 bottom
JP0  65,69 0 top
JP1  15.5,56.5 0 top
JP2  23.78,53.3 90 top
JP3  60,59 90 top
JP4  17,13 90 top
JP5  23.5,69 0 top
JP6  3,10 90 top
K1  16,13 0 top
LOGO1  36,36 0 top
MC1  36,31 270 top
OK1  52,48 270 top
R1  26,4 180 top
R2  23,7 180 top
R3  31,54 0 top
R4  41,54 0 top
R5  52,60 90 top
R11  39.5,31 0 bottom
R12  32.5,31 0 bottom
R13  36,50 0 bottom
RN1  20,20 0 top
RN2  20,25 0 top
RN3  37,61 0 top
RX  63,57.5 0 top
SV2  61,36 270 top
SV3  11,32 90 top
T1  17,4.5 0 top
U1  62,4.5 0 top
U$1  36,33.5 0 bottom
V1  57.82,13 270 top

### Tracks (layer width: path | path; a pad name or v marks a point on that pad's centre or on a via)
ANLG1
  Top 0.152: IC2.1 16.23,44.58 21.87,44.58 22.78,43.66 28.35,43.66 MC1.P$31
  Bottom 0.152: RN2.2 17.45,25.07 17.45,26.14 14.63,28.96 14.63,43.05 16.15,44.58 IC2.1
ANLG2
  Bottom 0.152: 17.41,35.17 19.96,32.61 19.96,25.07 RN2.3 | 17.41,35.17 16.23,36.35 16.23,36.96 IC2.4 | 17.41,35.17 23.39,41.15 28.35,41.15 MC1.P$30
ANLG3
  Top 0.152: MC1.P$29 28.35,38.56 28.35,37.8 25.38,34.82 25.38,30.94 23.85,29.41 IC2.8
  Bottom 0.152: RN2.4 22.55,25.07 22.55,28.12 23.77,29.34 IC2.8
ANLG4
  Top 0.152: RN2.5 25.15,25.07 25.15,28.73 27.13,30.71 27.13,34.82 28.35,36.04 MC1.P$28
  Bottom 0.152: IC2.11 23.85,36.96 27.51,36.96 28.35,36.12 MC1.P$28
AREF
  Top 0.152: C5.1 49.07,61.27 51.97,58.37 51.97,57.53 R5.1 51.89,57.53 51.44,57.07 49.45,57.07 45.41,53.03 43.59,53.03 36.8,46.25 28.42,46.25 MC1.P$32
D7  (via drill 0.3)
  Top 0.152: v58.14,53.65 56.31,53.65 52.65,49.99 52.65,49.3 v51.21,47.85 | v44.65,45.19 44.65,44.42 44.88,44.2 44.88,43.2 44.04,42.37 43.13,42.37 42.37,41.6 42.37,39.85 43.59,38.63 MC1.P$6
  Bottom 0.152: v58.14,53.65 61.49,57 J1.4 | v51.21,47.85 50.6,47.85 47.93,45.19 v44.65,45.19
DTCT1  (via drill 0.3)
  Top 0.152: v40.16,45.57 35.13,45.57 34.59,45.03 27.89,45.03 27.36,45.57 15.16,45.57 12.04,42.44 12.04,41 10.97,39.93 10.97,36.58 11.05,36.5 11.05,29.34 12.27,28.12 12.27,26.98 SV3.1
  Bottom 0.152: v40.16,45.57 40.16,44.2 39.62,43.66 37.41,43.66 37.26,43.51 37.26,42.67 43.59,36.35 43.59,36.12 MC1.P$7
DTCT2
  Top 0.152: SV3.7 12.27,34.59 12.27,35.74 11.28,36.73 11.28,39.78 12.34,40.84 12.34,41.38 13.95,42.98 27.36,42.98 27.89,42.44 32.46,42.44 35.05,45.03 42.29,45.03 43.59,43.74 MC1.P$4
GATE
  Top 0.152: IC2.6 16.23,31.93 16.23,34.44 IC2.5 16.31,34.44 18.75,34.44 23.77,39.47 IC2.12 23.85,39.55 23.85,42.06 IC2.13
  Bottom 0.152: MC1.P$27 28.42,33.6 28.42,34.37 29.64,35.59 29.64,36.58 28.8,37.41 25.91,37.41 23.85,39.47 IC2.12
GND  (via drill 0.3)
  Top 0.61: J3.1 50.06,66.06 50.22,66.06 51.44,67.28 54.71,67.28 55.93,66.06 J2.1 56.24,66.14 v58.52,68.43 | JP0.1 65.08,68.96 65.08,64.77 65.99,63.86 65.99,63.02 J1.1 | OK1.5 55.85,44.2 56.24,44.2 59.44,47.4 59.66,47.4 SV2.1 59.97,47.62 60.96,48.62 62.79,48.62 63.48,47.93 63.48,46.94 62.33,45.8 62.33,44.96 SV2.4 | v40.16,23.32 43.59,23.32 MC1.P$21 | IC1.13 55.85,35.05 55.85,34.75 57.61,32.99 57.61,31.77 55.85,30.02 IC1.11 | 51.59,13.03 53.95,13.03 V1.GND | 51.59,13.03 50.29,13.03 C1.2 | 51.59,13.03 51.59,9.14 | 51.59,9.14 51.59,8 C3.2 | 51.59,13.03 51.59,17.98 C2.2 51.82,18.21 53.57,19.96 57.68,19.96 C4.2 | IC1.9 55.85,24.99 58.45,24.99 59.21,25.76 61.11,25.76 62.26,24.61 SV2.20 | v45.95,23.32 47.24,23.32 48.16,22.4 IC1.7 | C7.2 13.26,44.96 12.12,43.81 10.29,43.81 v7.62,46.48 7.47,46.71 7.47,49.45 4.04,52.88 4.04,55.32 3.89,55.55 | C10.2 13.34,41 13.49,40.84 13.49,32.23 16.08,29.64 IC2.7 16.15,29.34 14.94,28.12 14.94,25.07 RN2.1 14.94,24.69 14.94,23.01 7.32,15.39 7.32,11.35 6.02,10.06 J6.2 | 3.89,55.55 17.3,68.96 20.95,68.96 JP5.1 | 3.89,55.55 2.9,55.55 J5.1 | v21.57,57.91 23.62,55.85 23.77,55.85 JP2.2 | T1.E 14.48,4.5 16.31,2.67 23.77,2.67 24.99,3.89 28.27,3.89 R1.1 28.57,4.04 v31.47,6.93 31.7,7.09 34.29,9.68 v34.44,9.68 34.67,9.53 36.5,7.7 37.26,7.7 38.71,9.14 51.59,9.14
  Bottom 0.61: v58.52,68.43 64.47,68.43 65,68.96 JP0.1 | SV2.4 62.26,44.88 62.26,42.6 SV2.6 62.33,42.29 63.48,41.15 63.48,36.8 62.33,35.66 62.33,34.75 SV2.12 62.33,34.44 62.33,33.83 63.48,32.69 63.48,25.91 62.41,24.84 SV2.20 62.26,24.54 57.76,20.04 C4.2 | 49.64,57.65 52.73,54.56 53.26,54.56 C8.2 53.57,54.41 54.79,54.41 56.24,52.96 57.61,52.96 59.66,50.9 59.66,47.47 SV2.1 | 49.64,57.65 49.07,58.22 49.07,58.67 C5.2 | C9.2 50.75,41.07 51.74,41.07 54.79,44.12 55.78,44.12 OK1.5 | 49.64,57.65 51.44,59.44 54.63,59.44 58.14,62.94 65.99,62.94 J1.1 | IC13.5 33.45,43.05 35.13,41.38 35.13,40.01 C13.2 35.2,39.7 35.2,30.56 37.03,28.73 37.03,27.36 37.8,26.59 38.25,26.59 IC12.2 38.56,26.59 38.56,25.68 IC12.3 38.63,25.3 38.63,24.16 IC12.4 38.79,23.85 38.79,23.32 | IC12.5 33.45,24.08 35.13,22.4 35.13,21.03 C12.2 35.28,20.73 35.28,20.19 36.5,18.97 38.79,18.97 | IC11.4 39.09,14.71 39.09,15.85 IC11.3 39.09,16.15 39.09,17.14 IC11.2 39.09,17.45 39.09,18.44 IC11.1 38.86,18.67 38.79,18.75 38.79,18.97 | 38.79,18.97 38.79,23.32 | 38.79,23.32 v40.16,23.32 | IC1.9 55.78,24.99 55.78,25.22 54.03,26.98 54.03,28.19 55.78,29.95 IC1.11 | IC1.7 48.23,22.33 48.23,21.34 51.51,18.06 C2.2 | U1.1 59.44,4.57 58.22,4.57 54.86,7.92 51.59,7.92 C3.2 | v45.95,23.32 43.66,23.32 MC1.P$21 | v7.62,46.48 6.02,46.48 J11.1 | C10.2 13.26,41.07 13.26,44.96 C7.2 | v21.57,57.91 21.57,68.43 21.03,68.96 JP5.1 | 34.63,9.87 33.76,10.74 33.22,10.74 IC11.10 32.92,10.9 32.92,12.04 IC11.11 32.92,12.34 32.92,13.34 IC11.12 32.92,13.64 32.92,14.63 IC11.13 32.61,14.63 32.16,14.63 31.39,15.39 31.39,16.38 | 34.63,9.87 34.9,9.6 39.01,9.6 IC11.8
  Bottom 0.61: 31.39,16.38 32.16,17.14 32.92,17.14 IC11.15 | MC1.P$12 28.42,18.29 29.41,18.29 31.17,16.54 31.39,16.38 | v31.47,6.93 35.13,6.93 C11.2 | J12.1 6.02,36.5 7.77,36.5 9.68,34.59 SV3.8 9.3,34.59 4.8,30.1 4.8,27.05 5.33,26.52 5.64,26.52 J13.1 5.94,26.44 5.94,24.38 4.72,23.16 4.72,17.14 5.33,16.54 5.71,16.54 J14.1 6.02,16.46 6.02,13.79 7.32,12.5 7.32,11.35 6.02,10.06 J6.2 | T1.E 14.4,4.5 C6.2 10.97,4.5 10.36,4.5 9.22,3.35 8.23,3.35 7.32,4.27 7.32,8.61 6.17,9.75 J6.2 | JP6.2 3.05,10.06 5.71,10.06 J6.2 | v34.44,9.68 34.63,9.87
  pour Top: -1,72 -1,-1 73,-1 73,73 -1,73
  pour Bottom: -2,74 -2,-2 74,-2 74,74
GPIO1
  Top 0.152: J2.2 58.06,66.06 58.6,66.06 59.59,67.06 60.43,67.06 61.04,66.45 61.04,64.77 51.66,55.4 48.69,55.4 45.49,52.2 45.49,37.26 44.88,36.65 44.88,34.82 43.66,33.6 MC1.P$8
GPIO2
  Top 0.152: J2.3 59.97,65.99 59.97,64.16 51.51,55.7 48.54,55.7 45.19,52.35 45.19,42.75 43.66,41.22 MC1.P$5
LED0
  Top 0.152: R4.2 43.51,54.03 41.22,54.03 40.01,55.24 37.64,55.24 33.45,51.05 28.65,51.05 28.42,51.28 MC1.P$34
LED0A  (via drill 0.3)
  Top 0.152: J6.1 5.94,7.92 5.49,7.47 3.05,7.47 JP6.1 3.05,7.54 3.05,7.77 1.22,9.6 1.22,53.65 v1.37,53.8 | v39.78,54.71 39.09,54.03 38.48,54.03 R4.1 38.41,53.95 34.52,50.06 27.96,50.06 25.3,47.4 v17.6,47.4 | v51.74,49.91 v48.77,52.88 | v53.95,47.7 53.95,44.73 56.31,42.37 59.66,42.37 SV2.5
  Bottom 0.152: v39.78,54.71 39.78,58.14 40.39,58.75 41.22,58.75 42.44,57.53 42.44,56.16 43.66,54.94 44.81,54.94 46.86,52.88 v48.77,52.88 | v53.95,47.7 v51.74,49.91 | v1.37,53.8 1.37,63.55 2.36,64.54 3.28,64.54 11.96,55.85 11.96,53.03 v17.6,47.4
LED1
  Bottom 0.152: R3.2 33.6,53.95 37.19,53.95 42.29,48.84 43.59,48.84 MC1.P$2
LED1A  (via drill 0.3)
  Top 0.152: v9.53,45.72 14.33,50.52 14.33,55.47 15.09,56.24 18.44,56.24 20.04,54.63 24.16,54.63 24.77,54.03 28.42,54.03 R3.1 | v9.53,41 9.53,40.69 6.63,37.8 6.63,30.63 6.71,30.56 6.71,12.72 6.02,12.04 J6.3 5.94,12.04 5.49,12.5 3.05,12.5 JP6.3
  Bottom 0.152: v9.53,41 v9.53,45.72
MIDIINSND
  Bottom 0.152: 48.12,59.17 49.3,60.35 53.49,60.35 55.93,62.79 D3.C | 48.12,59.17 48.08,59.13 48.08,58.37 49.3,57.15 49.3,51.66 48.23,50.6 48.23,49.3 OK1.2 | 48.12,59.17 47.93,59.36 33.38,59.36 31.24,57.23 30.71,57.23 RN3.2
MIN  (via drill 0.3)
  Top 0.152: v37.64,17.83 37.64,20.8 v38.02,21.18 | v32.08,51.59 33.53,51.59 37.57,55.63 47.55,55.63 49.53,57.61 v50.83,57.61 | IN.1 62.94,60.43 60.2,60.43 60.05,60.27 JP3.2 59.97,60.2 58.22,58.45 58.22,57.3 58.67,56.84 58.67,49.53 57.45,48.31 57.38,48.31 55.85,46.79 OK1.6
  Bottom 0.152: v37.64,17.83 37.64,14.33 38.56,13.41 39.01,13.41 IC11.5 | v38.02,21.18 38.02,21.79 38.25,22.02 38.25,22.71 35.05,25.91 35.05,29.95 34.37,30.63 34.37,39.01 31.17,42.22 31.17,50.67 v32.08,51.59 | v50.83,57.61 52.12,58.9 55.63,58.9 56.92,60.2 59.97,60.2 JP3.2
MIRTN
  Top 0.152: 50.41,47.82 52.35,49.76 52.35,51.59 55.93,55.17 D3.A | 50.41,47.82 49.38,46.79 48.23,46.79 OK1.3 | 50.41,47.82 56.84,41.38 59.51,41.38 61.04,39.85 62.26,39.85 SV2.8
MISND
  Bottom 0.152: RN3.15 30.71,64.77 31.24,64.77 34.29,61.72 48.16,61.72 50.52,64.08 66.45,64.08 67.06,63.48 67.06,50.83 62.1,45.87 61.87,45.87 60.73,44.73 60.73,40.84 59.74,39.85 SV2.7
MISO
  Bottom 0.152: MC1.P$19 28.42,13.18 29.64,11.96 29.64,10.21 28.88,9.45 27.89,9.45 24.99,12.34 22.33,12.34 19.36,15.32 16.46,15.32 10.44,21.34 10.44,21.79 10.74,22.1 10.74,26.75 12.27,28.27 12.27,29.41 SV3.3 12.27,29.49 11.28,30.48 11.28,37.95 3.73,45.49 3.73,52.2 1.75,54.18 1.75,61.95 2.82,63.02 2.82,63.48 J5.5
MO
  Bottom 0.152: RN3.6 40.84,57.15 40.84,55.4 43.66,52.58 44.12,52.58 45.95,50.75 45.95,48.92 46.56,48.31 50.9,48.31 50.98,48.39 51.44,48.39 51.74,48.08 51.74,45.03 49.07,42.37 49.07,38.71 49.76,38.02 49.76,31.55 48.23,30.02 IC1.4
MO2
  Bottom 0.152: RN3.8 45.87,57.23 45.26,57.23 43.43,59.05 35.66,59.05 34.14,57.53 34.14,55.93 32.61,54.41 32.61,49.68 35.81,46.48 35.81,42.82 38.18,40.46 38.18,36.04 41.83,32.38 41.83,28.5 43.2,27.13 46.02,27.13 48.16,24.99 IC1.6
MORTN
  Top 0.152: RN3.11 40.84,64.85 41.45,64.85 43.13,66.52 49,66.52 51.44,68.96 58.98,68.96 64.16,63.78 64.16,48.46 64.77,47.85 64.77,34.67 62.33,32.23 SV2.14
MOSI  (via drill 0.3)
  Top 0.152: 11.85,25.95 11.89,25.91 12.65,25.91 13.26,26.52 v13.26,31.32 | 11.85,25.95 10.74,27.05 10.74,29.79 9.75,30.79 9.75,31.93 SV3.6 | v37.64,12.72 39.62,10.74 43.59,10.74 MC1.P$17 | v35.05,15.32 30.56,15.32 28.88,16.99 25.91,16.99 24.54,15.62 23.47,15.62 22.78,16.31 22.78,16.84 21.72,17.91 v14.94,17.91 | v11.81,21.03 11.81,25.91 11.85,25.95
  Bottom 0.152: v13.26,31.32 13.26,32.46 13.56,32.77 13.56,39.4 12.27,40.69 12.27,52.12 2.9,61.49 J5.4 | v35.05,15.32 v37.64,12.72 | v11.81,21.03 v14.94,17.91
MOSND  (via drill 0.3)
  Top 0.152: v59.21,65 59.13,64.92 49,64.92 47.02,62.94 40.16,62.94 38.33,64.77 RN3.12 | v64.24,37.87 62.1,35.74 61.87,35.74 60.73,34.59 60.73,33.22 59.74,32.23 SV2.13
  Bottom 0.152: v59.21,65 59.51,65 59.59,64.92 66.52,64.92 66.6,65 67.06,65 67.36,64.69 67.36,41 v64.24,37.87
MRX
  Bottom 0.152: IC11.6 39.09,12.12 39.55,12.12 40.69,13.26 40.69,26.29 39.09,27.89 38.63,27.89 IC12.1
MRX+  (via drill 0.3)
  Top 0.152: v42.22,11.43 38.56,15.09 38.56,21.41 v37.72,22.25
  Bottom 0.152: 34.25,25.72 33.91,25.38 33.45,25.38 IC12.6 | 34.25,25.72 34.75,26.21 34.75,28.35 33.45,29.64 33.45,30.94 R12.1 | v42.22,11.43 42.67,11.89 44.04,11.89 44.88,12.72 44.88,13.26 46.1,14.48 47.93,14.48 49.76,16.31 51.66,16.31 57.68,22.33 57.68,26.44 59.36,28.12 59.59,28.12 60.73,29.26 60.73,35.13 59.74,36.12 SV2.9 | 34.25,25.72 v37.72,22.25
MRX-
  Bottom 0.152: R12.2 31.62,30.94 31.62,27.89 32.84,26.67 33.38,26.67 IC12.7 32.77,26.67 32,25.91 32,22.4 34.52,19.89 34.52,14.94 37.95,11.51 40.16,11.51 43.13,14.48 44.04,14.48 44.35,14.78 47.78,14.78 49.61,16.61 51.44,16.61 52.5,17.68 52.5,21.03 54.79,23.32 56.16,23.32 57.38,24.54 57.38,31.24 59.66,33.53 59.66,34.67 SV2.11
MRXDTCT  (via drill 0.3)
  Top 0.152: v33.98,19.66 33.98,20.04 v41.07,27.13
  Bottom 0.152: 40.92,26.98 42.37,25.53 42.37,20.34 43.13,19.58 44.12,19.58 46.63,22.1 46.63,22.78 47.17,23.32 49,23.32 53.49,27.81 53.49,32.16 55.47,34.14 56.84,34.14 58.75,36.04 58.75,37.64 59.36,38.25 61.34,38.25 62.26,37.34 SV2.10 | 40.92,26.98 40.46,27.43 40.46,30.94 R11.1 | v33.98,19.66 34.21,19.43 34.21,16.76 33.38,15.93 32.99,15.93 IC11.14 | 40.92,26.98 v41.07,27.13
MT
  Bottom 0.152: IC1.2 48.16,35.13 48.16,35.66 45.19,38.63 45.19,43.89 44.04,45.03 43.13,45.03 42.37,45.8 42.37,46.71 43.2,47.55 44.12,47.55 44.88,48.31 44.88,49.23 44.04,50.06 43.13,50.06 39.4,53.8 39.4,54.33 38.1,55.63 37.26,55.63 35.74,57.15 RN3.4
MTRTN  (via drill 0.3)
  Top 0.152: v29.64,54.71 29.64,58.14 35.66,64.16 35.66,64.77 RN3.13 | v33.83,38.41 33.83,34.44 v39.55,28.73 | v49.3,17.07 53.72,21.49 57.99,21.49 v58.67,22.17
  Bottom 0.152: v29.64,54.71 29.64,52.27 30.86,51.05 30.86,41.38 v33.83,38.41 | v39.55,28.73 40.16,28.12 40.16,27.28 42.06,25.38 42.06,18.14 43.13,17.07 v49.3,17.07 | v58.67,22.17 61.27,24.77 61.27,26.06 62.26,27.05 SV2.18
MTSND  (via drill 0.3)
  Top 0.152: v47.78,64.47 46.56,63.25 40.39,63.25 39.85,63.78 39.85,65.15 38.63,66.37 35.36,66.37 33.83,64.85 33.22,64.85 RN3.14 | v66.83,64.47 66.83,63.7 67.36,63.17 67.36,33.38 62.1,28.12 60.73,28.12 59.74,27.13 SV2.17
  Bottom 0.152: v66.83,64.47 v47.78,64.47
MTX+  (via drill 0.3)
  Top 0.152: v35.97,48.77 33.53,48.77 v32.46,47.7 | v52.96,28.8 57,28.8 57.84,29.64 59.66,29.64 SV2.15 | v50.29,28.65 50.29,32.38 48.54,34.14 47.17,34.14 46.25,35.05 v46.25,36.8
  Bottom 0.152: v35.97,48.77 36.88,49.68 36.88,49.99 R13.1 36.88,49.61 37.64,49.61 40.69,46.56 40.69,44.88 43.13,42.44 44.04,42.44 44.88,41.6 44.88,38.48 46.25,37.11 v46.25,36.8 | v32.46,47.7 32,47.24 32,46.56 32.38,46.18 34.59,46.18 34.75,46.02 34.75,45.19 33.98,44.42 33.45,44.42 IC13.6 | v52.96,28.8 50.44,28.8 v50.29,28.65
MTX-  (via drill 0.3)
  Top 0.152: v31.7,47.7 v33.53,49.53 | v52.96,32.84 52.96,30.86 54.71,29.11 56.84,29.11 58.37,30.63 60.12,30.63 61.04,29.72 62.26,29.72 SV2.16
  Bottom 0.152: v33.53,49.53 33.98,49.99 34.98,49.99 R13.2 34.98,49.91 34.98,49 36.12,47.85 36.12,43.36 38.48,41 38.48,39.47 43.13,34.82 44.04,34.82 44.88,33.98 44.88,31.32 47.09,29.11 49.23,29.11 v52.96,32.84 | v31.7,47.7 31.7,46.41 32.46,45.64 33.38,45.64 IC13.7
RLY
  Top 0.152: R2.2 20.5,7.01 24.23,7.01 26.67,9.45 30.4,9.45 36.35,15.39 36.35,21.64 42.37,27.66 42.37,29.72 43.59,30.94 MC1.P$9
RLYDRV
  Top 0.152: 23.47,4.5 23.47,4.88 25.53,6.93 R2.1 | 23.47,4.5 23.47,4.04 R1.2 23.47,4.5 | 23.47,4.5 19.58,4.5 T1.B
RLYOUT  (via drill 0.3)
  Top 0.152: v58.22,3.73 58.22,8.38 v62.87,13.03
  Bottom 0.152: v58.22,3.73 57.3,2.82 56.31,2.82 53.65,5.49 42.98,5.49 38.94,1.45 28.12,1.45 20.12,9.45 20.12,10.82 18.14,12.8 14.25,12.8 11.58,15.47 10.97,15.47 K1.10 | v62.87,13.03 63.78,13.95 J4.2
RLYSNK
  Top 0.152: 15.24,8.84 15.24,6.33 16.99,4.57 T1.C | 15.24,8.84 15.24,11.73 13.49,13.49 13.49,15.47 K1.9 | 15.24,8.84 21.41,8.84 21.72,9.14 23.93,9.14 D2.A
RST
  Top 0.152: MC1.P$13 28.42,20.88 32.92,20.88 42.37,30.33 42.37,31.47 43.13,32.23 44.12,32.23 44.88,31.47 44.88,22.1 43.66,20.88 MC1.P$22
  Bottom 0.152: SV2.3 59.66,44.88 59.66,43.66 53.49,37.49 53.49,32.61 49.76,28.88 49.76,24.54 48.84,23.62 47.02,23.62 44.27,20.88 43.66,20.88 MC1.P$22
RX  (via drill 0.3)
  Top 0.152: JP3.1 60.05,57.68 60.2,57.53 62.94,57.53 RX.1 63.02,57.45 63.02,49.15 64.01,48.16 64.01,40.16 62.71,38.86 56.69,38.86 53.65,41.91 52.88,41.91 51.66,40.69 51.66,40.62 48.62,37.57 48.31,37.57 IC1.1 48.23,37.57 48.23,36.96 50.83,34.37 50.83,23.09 46.63,18.9 44.2,18.9 43.66,18.36 MC1.P$14 43.59,18.29 42.14,16.84 v42.14,12.72 | v23.85,14.48 34.21,14.48 v34.44,14.25
  Bottom 0.152: v42.14,12.72 40.31,10.9 39.09,10.9 IC11.7 39.01,10.9 38.1,10.9 34.75,14.25 v34.44,14.25 | v23.85,14.48 23.85,14.71 21.41,17.14 20.88,17.14 18.06,19.96 17.53,19.96 RN1.2
SCK
  Bottom 0.152: MC1.P$18 28.35,10.74 21.64,17.45 21.64,20.34 20.42,21.57 18.97,21.57 16.54,24 16.54,26.59 12.34,30.79 12.34,31.93 SV3.5 12.34,32 13.26,32.92 13.26,37.49 11.96,38.79 11.96,49.84 2.9,58.9 2.9,59.44 J5.3
SCL  (via drill 0.3)
  Top 0.152: v56.46,58.98 51.66,54.18 51.66,54.1 50.98,53.42 47.17,53.42 45.8,52.05 45.8,37.11 45.41,36.73 v45.41,30.02 | v6.02,21.11 6.02,30.18 v6.17,30.33 6.1,30.33 v6.1,43.89 | v6.55,51.51 10.67,51.51 14.02,54.86 14.02,55.63 15.16,56.77 19.66,56.77 23.77,60.88 JP2.4 | v42.37,32.23 42.37,31.93 40.08,29.64 40.08,28.5 39.78,28.19 37.11,28.19 v32.99,32.31
  Bottom 0.152: v56.46,58.98 65.99,58.98 J1.3 | v45.41,30.02 45.19,30.02 43.66,28.5 MC1.P$10 43.97,28.88 42.37,30.48 v42.37,32.23 | v6.02,21.11 6.02,19.51 J14.4 | J13.4 6.02,29.57 6.17,29.72 v6.17,30.33 8.84,32.99 9.53,32.99 10.74,34.21 10.74,34.9 10.13,35.51 9.91,35.51 8.76,36.65 8.76,37.11 6.4,39.47 6.02,39.47 J12.4 | v6.1,43.89 4.72,45.26 4.72,48.54 5.64,49.45 5.94,49.45 J11.4 6.02,49.53 6.02,50.98 v6.55,51.51 | 29.91,33.34 29.95,33.38 29.95,51.51 28.42,53.03 28.12,53.03 24.99,56.16 24.99,59.74 23.85,60.88 JP2.4 | 29.91,33.34 28.88,32.31 27.96,32.31 27.13,31.47 27.13,30.71 24.16,27.74 24.16,24.69 22.55,23.09 22.55,20.04 RN1.4 | v32.99,32.31 30.94,32.31 29.91,33.34
SDA  (via drill 0.3)
  Top 0.152: v7.85,21.57 v10.97,21.57 | v5.03,43.43 5.03,45.49 v5.26,45.72 5.18,45.72 5.18,50.75 1.75,54.18 1.75,63.93 8.61,70.79 26.44,70.79 27.05,70.18 27.05,67.82 23.85,64.62 23.85,63.48 JP2.5 | v7.24,33.91 v7.24,30.63 | v62.33,30.86 67.06,35.59 67.06,59.44 66.06,60.43 66.06,60.96 J1.2 | v46.33,13.95 46.1,13.95 44.12,11.96 42.14,11.96 39.62,14.48 39.62,23.55 41.99,25.91 43.59,25.91 MC1.P$11
  Bottom 0.152: 7.92,25.91 7.92,27.74 7.2,28.46 | 7.92,25.91 7.92,21.57 | 7.92,21.57 7.92,20.12 6.33,18.52 6.02,18.52 J14.3 | 7.2,28.46 7.16,28.5 6.02,28.5 J13.3 | v10.97,21.57 17.83,21.57 19.36,20.04 19.96,20.04 RN1.3 | 7.92,21.57 v7.85,21.57 | v5.03,43.43 5.03,39.17 5.64,38.56 5.94,38.56 J12.3 5.56,38.56 5.03,38.02 5.03,36.12 v7.24,33.91 | v5.26,45.72 5.26,45.87 5.03,46.1 5.03,47.85 5.64,48.46 5.94,48.46 J11.3 | v7.24,30.63 7.24,28.5 7.2,28.46 | v62.33,30.86 62.1,30.86 61.04,29.79 61.04,27.05 59.51,25.53 59.28,25.53 57.99,24.23 57.99,22.17 51.82,16 49.91,16 47.85,13.95 v46.33,13.95 46.33,11.66 43.66,8.99 27.89,8.99 24.84,12.04 22.17,12.04 21.11,13.11 15.93,13.11 15.24,13.79 15.24,15.7 10.13,20.8 10.13,24.61 8.84,25.91 7.92,25.91
THS
  Top 0.152: U1.2 61.95,4.5 61.11,4.5 59.44,2.82 47.7,2.82 45.03,5.49 42.22,5.49 38.86,2.13 14.86,2.13 12.5,4.5 12.5,16.54 14.4,18.44 23.55,18.44 25.07,19.96 RN1.5
  Bottom 0.152: RN1.5 25.15,20.04 25.15,23.09 27.13,25.07 27.13,29.72 28.35,30.94 MC1.P$26
TX  (via drill 0.3)
  Top 0.152: IC1.3 48.23,32.54 49.76,31.01 49.76,29.64 48.23,28.12 48.23,27.51 IC1.5 48.16,27.43 45.41,24.69 45.41,20.88 44.12,19.58 43.2,19.58 41.91,18.29 v41.91,17.45
  Bottom 0.152: IC13.4 38.63,43.05 38.63,41.91 43.2,37.34 44.12,37.34 46.63,34.82 46.63,34.14 48.16,32.61 IC1.3 | v41.91,17.45 43.59,15.77 MC1.P$15
V+  (via drill 0.3)
  Top 0.61: JP1.1 13.03,55.24 13.03,56.08 14.25,57.3 14.25,58.29 22.94,66.98 24,66.98 25.98,68.96 JP5.3 | C1.1 47.7,13.03 47.7,16.76 46.48,17.98 C2.1 46.71,18.14 51.36,22.78 v51.36,36.12 | v58.83,43.59 60.12,43.59 60.96,44.42 60.96,45.57 62.26,46.86 62.26,47.4 SV2.2 | D1.C 56.77,4.04 56.77,12.8 54.03,15.54 V1.IN | v61.42,67.28 64.69,64.01 v64.69,49.84
  Bottom 0.61: v51.36,36.12 v58.83,43.59 | V1.IN 53.95,15.47 50.22,15.47 47.78,13.03 C1.1 | v61.42,67.28 58.52,67.28 57.76,68.05 46.86,68.05 44.73,65.91 44.73,63.93 43.81,63.02 42.9,63.02 42.22,63.7 42.22,65.68 38.94,68.96 26.06,68.96 JP5.3 | v64.69,49.84 62.33,47.47 SV2.2
VCC  (via drill 0.3)
  Top 0.61: v36.65,44.42 v35.28,44.42 35.13,44.2 35.13,40.84 32.23,37.95 32.23,29.95 33.22,28.96 v33.38,28.73 33.38,28.35 31.89,26.86 | v36.88,19.74 v36.88,8.46 | 31.89,26.86 28.42,23.39 MC1.P$23 28.12,23.24 26.82,21.95 26.21,21.95 | 26.21,21.95 17.14,21.95 15.24,20.04 14.94,20.04 RN1.1 14.63,19.96 13.03,19.96 8.76,15.7 8.76,4.57 C6.1 | 26.21,21.95 26.21,18.82 24.23,16.84 24,16.84 D2.C | 31.89,26.86 v34.98,23.77 | OK1.7 55.85,49.3 55.85,51.74 OK1.8 | C9.1 53.34,41 55.78,38.56 55.78,37.64 IC1.14 55.7,37.34 52.2,33.83 52.2,26.29 54.71,23.77 58.37,23.77 | 58.37,23.77 59.13,24.54 59.66,24.54 SV2.19 | U1.3 64.47,4.57 64.47,17.6 58.52,23.55 58.37,23.77 | 7.77,27.51 v7.39,27.51 | 7.77,27.51 9.68,29.41 SV3.4 9.6,29.72 9.6,30.18 8,31.77 8,36.73 7.39,37.34 v7.24,37.57 10.67,41 C10.1 | RN3.3 33.22,57.15 33.53,57.15 35.28,55.4 36.5,55.4 38.25,57.15 RN3.5 38.48,57.38 40.08,58.98 41.3,58.98 43.05,57.23 43.28,57.23 RN3.7 | C7.1 10.74,45.03 10.74,46.18 15.47,50.9 15.47,55.17 JP1.3 | v48.62,54.56 50.67,54.56 C8.1 | v8.61,25.38 8.61,26.36 7.92,27.05 7.92,27.28 7.77,27.51
  Bottom 0.61: IC13.2 38.63,45.57 38.63,44.42 IC13.3 38.33,44.42 v36.65,44.42 | IC13.8 33.45,46.86 34.67,46.86 35.28,46.25 v35.28,44.42 35.28,42.6 36.8,41.07 36.8,40.01 C13.1 36.96,39.7 36.96,36.5 38.48,34.98 38.48,31.01 R11.2 | 6.71,17.45 6.02,17.45 J14.2 | 6.71,17.45 8.53,15.62 8.53,8.61 | 8.53,8.61 8.53,4.72 8.69,4.57 C6.1 | 8.53,8.61 11.35,8.61 13.18,10.44 13.41,10.44 K1.2 | v36.88,8.46 36.88,7.01 C11.1 | v36.88,19.74 36.88,20.95 C12.1 36.73,21.26 36.73,22.02 v34.98,23.77 | IC11.16 32.92,18.52 32.92,18.82 28.42,23.32 MC1.P$23 | v33.38,28.73 33.38,27.96 IC12.8 | C8.1 50.75,54.48 51.66,54.48 54.33,51.82 55.78,51.82 OK1.8 | J1.5 65.99,54.94 65.99,52.81 60.96,47.78 60.96,46.94 60.27,46.25 59.21,46.25 56.24,49.23 55.85,49.23 OK1.7 55.7,49 55.7,48.23 49.61,42.14 49.61,40.54 50.29,39.85 52.12,39.85 C9.1 | v7.39,27.51 6.02,27.51 J13.2 | v7.24,37.57 6.02,37.57 J12.2 | 7.32,47.47 8.91,47.47 10.67,45.72 10.67,45.03 C7.1 10.74,44.73 10.74,41.07 C10.1 | 7.32,47.47 6.02,47.47 J11.2 | 7.32,47.47 7.32,53.49 3.35,57.45 2.9,57.45 J5.2 | IC2.14 23.85,44.65 23.85,47.55 24.84,48.54 24.84,52.27 23.85,53.26 JP2.1 23.47,53.34 22.33,53.34 | 22.33,53.34 18.14,53.34 16.31,55.17 15.54,55.17 JP1.3 | 23.47,66.6 23.47,65.15 22.33,64.01 22.33,53.34 | 23.47,66.6 23.47,68.96 JP5.2 | 23.47,66.6 29.49,66.6 | 29.49,66.6 33.68,66.6 34.37,65.91 34.37,63.93 36.04,62.26 45.64,62.26 47.02,63.63 47.02,64.85 49.45,67.28 50.52,67.28 51.74,66.06 51.97,66.06 J3.2 | 29.49,66.6 29.49,56.08 30.18,55.4 31.17,55.4 32.92,57.15 33.15,57.15 RN3.3 | v48.62,54.56 45.95,54.56 43.36,57.15 RN3.7 | v8.61,25.38 8.61,19.43 6.86,17.68 6.71,17.45
VCC/2
  Top 0.61: R5.2 51.97,62.48 47.32,62.48 44.58,59.74 33.45,59.74 31.77,58.06 31.77,55.7 28.88,52.81 25.3,52.81 24.38,51.89 21.34,51.89 18.06,55.17 JP1.5
VIN  (via drill 0.3)
  Top 0.61: v25.6,41.68 25.6,36.5 24.69,35.59 22.63,35.59 22.02,34.98 22.02,27.81 23.93,25.91 23.93,23.85 25.07,22.71 v25.68,22.71
  Bottom 0.61: v25.6,41.68 25.6,42.6 24.99,43.2 22.94,43.2 14.25,51.89 14.25,55.7 13.03,56.92 13.03,57.76 JP1.2 | v25.68,22.71 25.68,21.72 26.9,20.5 26.9,17.22 28.35,15.77 MC1.P$20
VOUT  (via drill 0.3)
  Top 0.61: JP1.4 15.54,57.84 17.98,57.84 JP1.6 | v24.92,2.67 28.8,2.67 32.16,6.02 33.98,6.02 35.97,4.04 38.48,4.04 F1.2 | v13.03,13.18 v14.71,11.51 | v7.24,21.03 v9.3,18.97 | v5.49,22.78 5.49,29.87 4.27,31.09 v4.27,50.83 | v12.5,59.05 v6.55,53.11
  Bottom 0.61: v24.92,2.67 19.13,2.67 18.14,3.66 18.14,8.08 v14.71,11.51 | v13.03,13.18 10.97,13.18 9.3,14.86 v9.3,18.97 | v5.49,22.78 v7.24,21.03 | v6.55,53.11 v4.27,50.83 | v12.5,59.05 14.25,59.05 15.47,57.84 JP1.4
VOUTRAW
  Top 0.61: K1.5 21.11,10.52 21.11,15.47 K1.6 20.88,14.33 17.07,14.33 JP4.2 | C3.1 46.48,7.92 46.48,6.71 49.15,4.04 D1.A
  Bottom 0.61: 60.27,14.02 60.27,19.96 C4.1 | 60.27,14.02 62.26,12.04 63.78,12.04 J4.1 | 60.27,14.02 60.05,13.87 56.69,10.52 54.03,10.52 V1.OUT 53.72,10.36 52.27,10.36 49.91,8 46.48,8 C3.1 46.18,7.85 39.85,7.85 33.98,1.98 28.96,1.98 21.11,9.83 21.11,10.44 K1.5
VOUTRAW2  (via drill 0.3)
  Top 0.61: v24.61,11.51 24.61,12.57 22.25,14.94 22.25,16.61 21.49,17.37 17.6,17.37 15.01,14.78 15.01,13.72 JP4.1
  Bottom 0.61: K1.1 10.97,10.52 11.2,10.52 12.95,12.27 16.46,12.27 JP4.1 | v24.61,11.51 32.08,4.04 33.45,4.04 F1.1

### Text on the board
tNames: Vcc | GPIO | Pineapple II | PWR | Insulating Tape / Here | SE/Lucent-P1 0.0.2-X | V+ | GND | RTC1 | SD | SC | NC | 221 | (OUT2) | (OUT2) | SPI | 1k | MKR | NC | 100n | G | 121 | USB | 121 | Close / Here | 5V | SparkFun / Real Time Clock / Module (12708) | (3V3) | DC9-12V | Min. requirement / for MIDI IN | TLP552 | Stepper | 100n | 4066B | 74LS07 | Back Panel | 10k | Vcc | 100n | 4.7k | 470n | Vin | Min. requirement / for MIDI OUT | + | 5V1.5A | Arduino Micro | MC1 | 1u | C1815 | 1k | DS18B20+ | LED | 47k | 1A
bNames: G | Vcc | G | G1 | G2 | Insulating Tape / Here | IN | THRU | OUT | V+ | GND | Vcc | MI | GND | MO | IN-RX | NC | SND | RTN | SDA | SCK | Vin (MC) | Vout (Reg) | Vout (Reg) | SCL | Vcc | D7 | GND | PWRSEL | Close | Vcc | Ext. V+ | Vcc | Vcc/2 | Qwiic/5V | 3V3 | PWRSEL | LTC485 | Dual | Regulator | TX | Arduino | Direct 5V | LTC485 | Vcc | Bottom / View | Vcc | RLYJMP | Vin | V+ | LED1 | 74153 | Open JP1 | Relay | Don't / Close | Voutraw | LED0 | RX | Vout